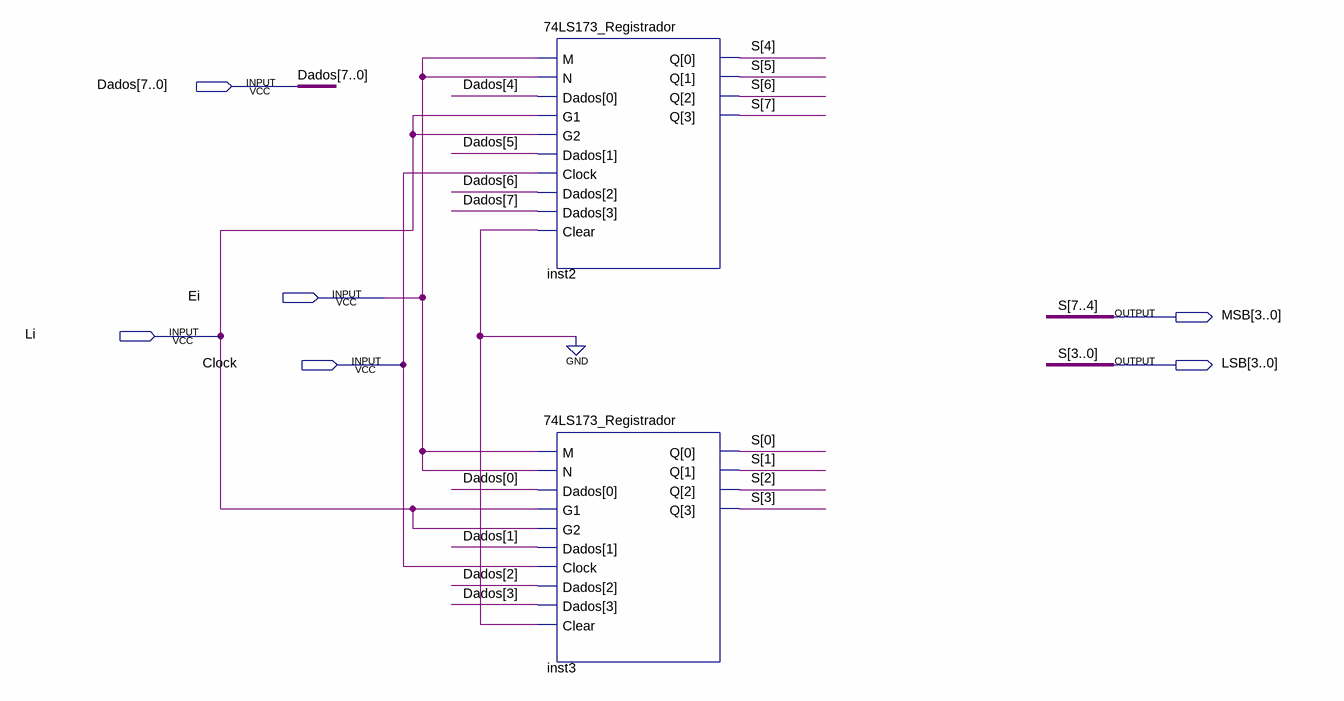
[diagram p0: schematic sheet]
// Quartus schematic Instruction_Register.bdf as structural Verilog: 2 symbols, 6 pins
module Instruction_Register (
  input  [7:0] Dados,
  input  Ei,
  input  Li,
  input  Clock,
  output [3:0] MSB,
  output [3:0] LSB
);

  \74LS173_Registrador  inst2 (
    .M(Ei), .N(Ei), .Dados(Dados[7:4]), .G1(Li), .G2(Li), .Clock(Clock), .Clear(1'b0), .Q(MSB));
  \74LS173_Registrador  inst3 (
    .M(Ei), .N(Ei), .Dados(Dados[3:0]), .G1(Li), .G2(Li), .Clock(Clock), .Clear(1'b0), .Q(LSB));

  // Other names for the same wires on the sheet: S[7:0] = {MSB, LSB}
endmodule
